# Altium schematic sheet Project_Kondrashova_motor_driver.SchDoc: =title_line_1 + title_line_2
size 594 x 420 mm; SheetNumber: n
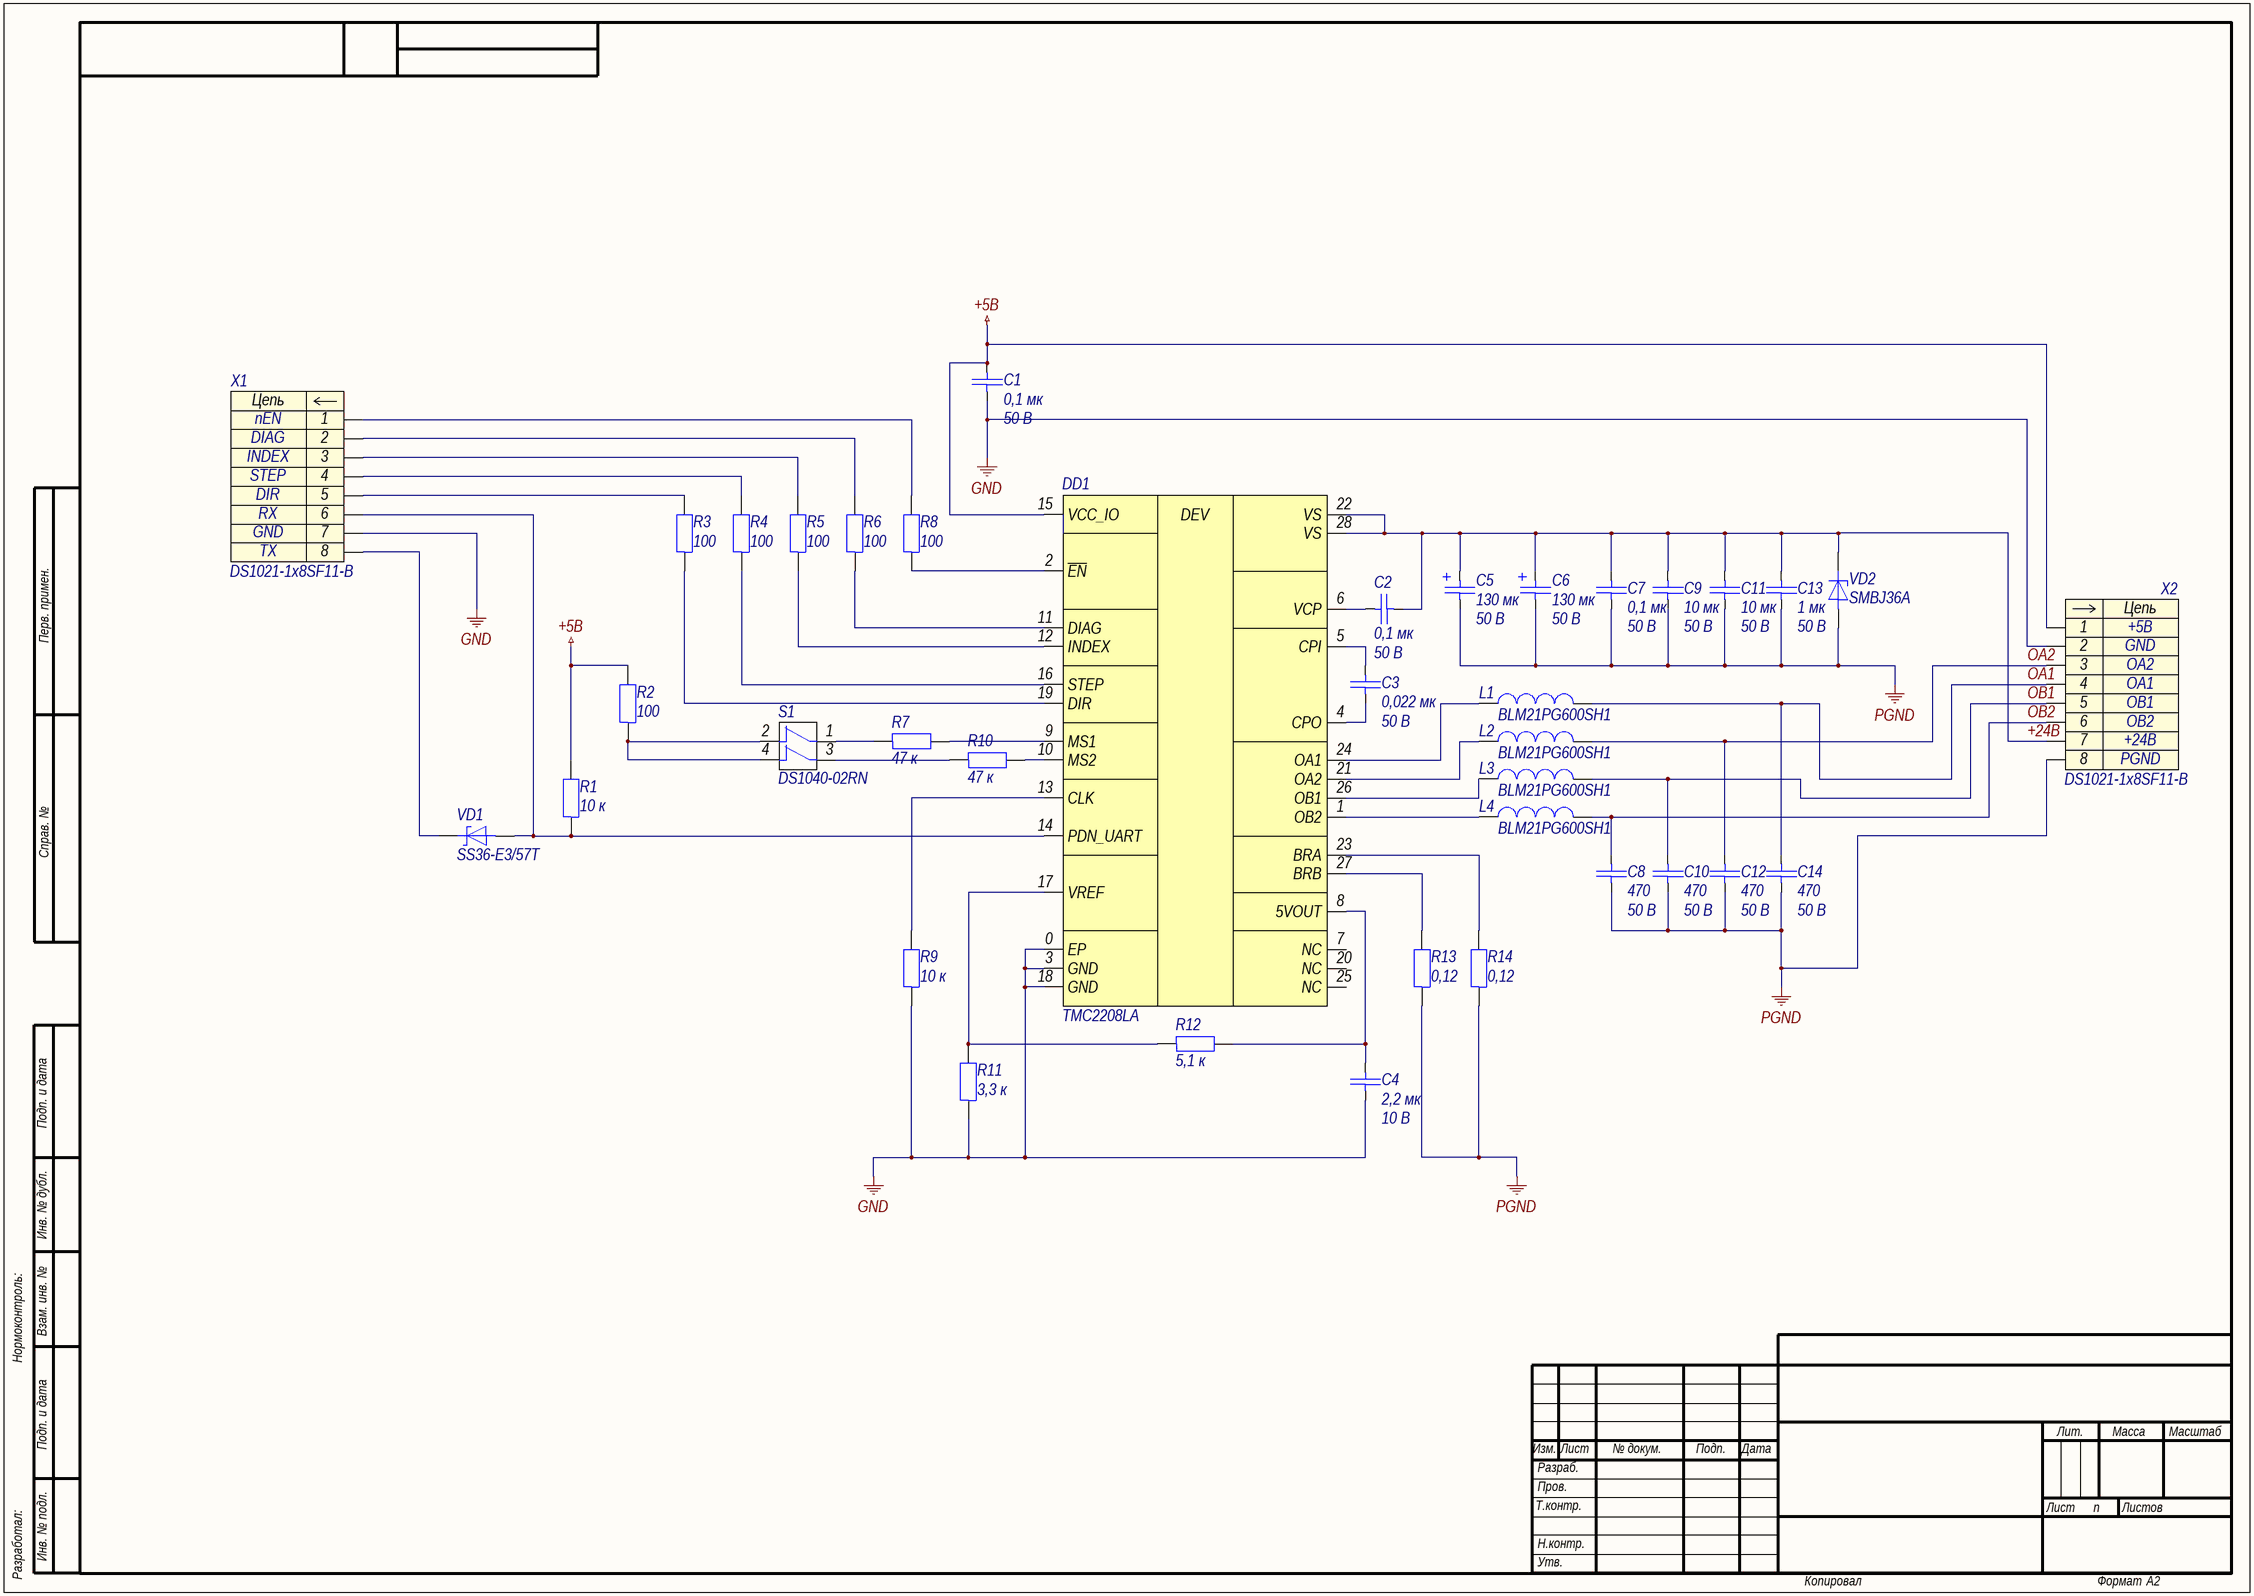
[diagram p0: Project_Kondrashova_motor_driver.SchDoc]

## Parts
C1  0,1 мк  Напряжение: 50 В  [C0603]
C2  0,1 мк  Напряжение: 50 В  [C0603]
C3  0,022 мк  Напряжение: 50 В  [C0603]
C4  2,2 мк  Напряжение: 10 В  [C0603]
C5  130 мк  Напряжение: 50 В  [C7343-43]
C6  130 мк  Напряжение: 50 В  [C7343-43]
C7  0,1 мк  Напряжение: 50 В  [C0603]
C8  470  Напряжение: 50 В  [C0603]
C9  10 мк  Напряжение: 50 В  [C2220]
C10  470  Напряжение: 50 В  [C0603]
C11  10 мк  Напряжение: 50 В  [C2220]
C12  470  Напряжение: 50 В  [C0603]
C13  1 мк  Напряжение: 50 В  [C1210]
C14  470  Напряжение: 50 В  [C0603]
DD1  TMC2208LA  [QFN-28-P50-500X500X90-L55X25-T310X310]
L1  BLM21PG600SH1  [MI-2-0805]
L2  BLM21PG600SH1  [MI-2-0805]
L3  BLM21PG600SH1  [MI-2-0805]
L4  BLM21PG600SH1  [MI-2-0805]
R1  10 к  [R0603]
R2  100  [R0603]
R3  100  [R0603]
R4  100  [R0603]
R5  100  [R0603]
R6  100  [R0603]
R7  47 к  [R0603]
R8  100  [R0603]
R9  10 к  [R0603]
R10  47 к  [R0603]
R11  3,3 к  [R0603]
R12  5,1 к  [R0603]
R13  0,12  [R0603]
R14  0,12  [R0603]
S1  DS1040-02RN  [DS1040-02RN]
VD1  SS36-E3/57T  [DO-214AB-790X590X262]
VD2  SMBJ36A  [SMBJ36A]
X1  DS1021-1x8SF11-B  [DS1021-1X8SF11-B]
X2  DS1021-1x8SF11-B  [DS1021-1X8SF11-B]

## Nets
+5В: C1.1 DD1.15(VCC_IO) R1.2 R2.2 X2.1
GND: C1.2 C4.2 DD1.0(EP) DD1.3(GND) DD1.18(GND) R9.1 R11.1 X1.7 X2.2
PGND: C5.2 C6.2 C7.2 C8.2 C9.2 C10.2 C11.2 C12.2 C13.2 C14.2 R13.1 R14.1 VD2.2 X2.8
+24В: C2.2 C5.1 C6.1 C7.1 C9.1 C11.1 C13.1 DD1.22(VS) DD1.28(VS) VD2.1 X2.7
OA1: C14.1 L1.2 X2.4
OA2: C12.1 L2.2 X2.3
OB1: C10.1 L3.2 X2.5
OB2: C8.1 L4.2 X2.6
NetC2_1: C2.1 DD1.6(VCP)
NetC3_1: C3.1 DD1.5(CPI)
NetC3_2: C3.2 DD1.4(CPO)
NetC4_1: C4.1 DD1.8(5VOUT) R12.2
NetDD1_1: DD1.1(OB2) L4.1
NetDD1_2: DD1.2(~{EN}) R8.1
NetDD1_9: DD1.9(MS1) R7.2
NetDD1_10: DD1.10(MS2) R10.2
NetDD1_11: DD1.11(DIAG) R6.1
NetDD1_12: DD1.12(INDEX) R5.1
NetDD1_13: DD1.13(CLK) R9.2
NetDD1_14: DD1.14(PDN_UART) R1.1 VD1.2 X1.6
NetDD1_16: DD1.16(STEP) R4.1
NetDD1_17: DD1.17(VREF) R11.2 R12.1
NetDD1_19: DD1.19(DIR) R3.1
NetDD1_21: DD1.21(OA2) L2.1
NetDD1_23: DD1.23(BRA) R14.2
NetDD1_24: DD1.24(OA1) L1.1
NetDD1_26: DD1.26(OB1) L3.1
NetDD1_27: DD1.27(BRB) R13.2
NetR2_1: R2.1 S1.2 S1.4
NetR3_2: R3.2 X1.5
NetR4_2: R4.2 X1.4
NetR5_2: R5.2 X1.3
NetR6_2: R6.2 X1.2
NetR7_1: R7.1 S1.1
NetR8_2: R8.2 X1.1
NetR10_1: R10.1 S1.3
NetVD1_1: VD1.1 X1.8

Not connected (* = marked no-connect by the designer): DD1 7(NC) 20(NC) 25(NC)

## Notes on the sheet
- Перв. примен.
- Справ. №
- Подп. и дата
- Инв. № дубл.
- Нормоконтроль:
- Взам. инв. №
- Изм.
- Лист
- № докум.
- Подп.
- Дата
- Лит.
- Масса
- Масштаб
- Т.контр.
- Пров.
- Разраб.
- Листов
- Разработал:
- Инв. № подл.
- Н.контр.
- Утв.
- Копировал
- Формат
- А2
- (in symbol dd0002) DEV
- (in symbol x0024) Цепь

## Library data of the parts
C1 C2 C7 = c0063: =Описание; ID: c0063; Фамилия: Ларионов; Описание: Конденсатор керамический чип 0603 100 нФ 50 В ±5 %; Наименование: CC0603JRX7R9BB104; Производитель: YAGEO Corp.; Отклонение: ±5 %; Рабочие температуры: от –55 °С до +125 °С; Температурный коэффициент емкости: X7R; Корпус: 0603; Номинал: 0,1 мк; Номинальное напряжение: 50 В; HelpURL: https://www.yageo.com/upload/media/product/productsearch/datasheet/mlcc/UPY-GPHC_X7R_6.3V-to-50V_20.pdf
C3 = c0047: =Описание; ID: c0047; Фамилия: Паньков; Описание: Конденсатор керамический чип 0603 22 нФ 50 В ±10 %; Наименование: CC0603KRX7R9BB223; Производитель: YAGEO Corp.; Отклонение: ±10 %; Рабочие температуры: от –55 °С до +125 °С; Температурный коэффициент емкости: X7R; Корпус: 0603; Номинал: 0,022 мк; Номинальное напряжение: 50 В; HelpURL: https://www.yageo.com/upload/media/product/productsearch/datasheet/mlcc/UPY-GPHC_X7R_6.3V-to-50V_20.pdf
C4 = c0099: =Описание; ID: c0099; Фамилия: Паньков; Описание: Конденсатор керамический чип 0603 2,2 мкФ 10 В ±10 %; Наименование: CC0603KRX5R6BB225; Производитель: YAGEO Corp.; Отклонение: ±10 %; Рабочие температуры: от –55 °С до +85 °С; Температурный коэффициент емкости: X5R; Корпус: 0603; Номинал: 2,2 мк; Номинальное напряжение: 10 В; HelpURL: https://www.yageo.com/upload/media/product/productsearch/datasheet/mlcc/UPY-GPHC_X5R_4V-to-50V_26.pdf
C5 C6 = c0150: =Описание; ID: c0150; Фамилия: Паньков; Описание: Конденсатор танталовый чип 7343-43 150 мкФ 16 В ±10 %; Наименование: 293D157X9016E2TE3; Производитель: Vishay Intertechnology, Inc.; Отклонение: ±10 %; Эквивалентное последовательное сопротивление: 0,5 Ом; Среднеквадратичный размах пульсации тока: 0,57 А; Рабочие температуры: от –55 °С до +125 °С; Корпус: 7343-43; Номинал: 130 мк; Номинальное напряжение: 50 В; HelpURL: https://www.vishay.com/capacitors/list/product-40002/
C8 C10 C12 C14 = c0154: =Описание; ID: c0154; Описание: Конденсатор керамический чип 0603 470мкФ 50 В ±5 %; Наименование: CC0603JPX7R9BB101; Производитель: YAGEO Corp.; Отклонение: ±5 %; Рабочие температуры: от –55 °С до +125 °С; Температурный коэффициент емкости: X7R; Корпус: 0603; Номинал: 470; Номинальное напряжение: 50 В; HelpURL: https://www.yageo.com/upload/media/product/productsearch/datasheet/mlcc/UPY-GPHC_X7R_6.3V-to-50V_20.pdf
C9 C11 = c0152: =Описание; ID: c0152; Описание: Конденсатор керамический чип 2220 10 мк 50 В ±2 %; Производитель: KEMET Corporation; Отклонение: ±2 %; Рабочие температуры: от –55 °С до +125 °С; Температурный коэффициент емкости: X7R; Корпус: 2220; Номинал: 10 мк; Номинальное напряжение: 50 В
C13 = c0153: =Описание; ID: c0153; Описание: Конденсатор керамический чип 1210 1 мк 50 В ±10 %; Производитель: YAGEO Corp.; Отклонение: ±5 %; Рабочие температуры: от –55 °С до +125 °С; Температурный коэффициент емкости: C0G; Корпус: 1210; Номинал: 1 мк; Номинальное напряжение: 50 В; HelpURL: https://www.yageo.com/upload/media/product/productsearch/datasheet/mlcc/UPY-NP0X7R_MV_100-to-630V_22.pdf
DD1 = dd0002: =Описание; ID: dd0002
L1-L4 = l0004: =Описание; ID: l0004; Фамилия: Самарин; Описание: Ферритовая бусина 60 Ом ±25 %; Производитель: Murata Manufacturing Co., Ltd.; Сопротивление, 100 МГц: 60 Ом; Отклонение, 100 МГц: ±25 %; Сопротивление при постоянном токе: 0,1 Ом; Рабочие температуры: от –55 °С до +125 °С; Корпус: 0805; Наименование: BLM21PG600SH1; HelpURL: https://www.laird.com/products/inductive-components-emc-components-and-ferrite-cores/ferrite-chip-beads/0805-series/mi0805k400r-10
R1 R9 = r0105: =Описание; ID: r0105; Фамилия: Самарин; Описание: Резистор чип 0603 10 кОм ±1 % 0,1 Вт; Наименование: RC0603FR-0710KL; Производитель: YAGEO Corp.; Отклонение: ±1 %; Номинальное напряжение: 75 В; Номинальный ток: 1 А; Рабочие температуры: от –55 °С до +155 °С; Корпус: 0603; Примечание: Ряд E24; Номинал: 10 к; HelpURL: https://www.yageo.com/upload/media/product/productsearch/datasheet/rchip/PYu-RC_Group_51_RoHS_L_11.pdf
R2-R6 R8 = r0052: =Описание; ID: r0052; Фамилия: Самарин; Описание: Резистор чип 0603 100 Ом ±1 % 0,1 Вт; Наименование: RC0603FR‍‐07100RL; Производитель: YAGEO Corp.; Отклонение: ±1 %; Номинальное напряжение: 75 В; Номинальный ток: 1 А; Рабочие температуры: от –55 °С до +155 °С; Корпус: 0603; Примечание: Ряд E24; Номинал: 100; HelpURL: https://www.yageo.com/upload/media/product/productsearch/datasheet/rchip/PYu-RC_Group_51_RoHS_L_11.pdf
R7 R10 = r0129: =Описание; ID: r0129; Фамилия: Паньков; Описание: Резистор чип 0603 47 кОм ±1 % 0,1 Вт; Наименование: RC0603FR-0747KL; Производитель: YAGEO Corp.; Отклонение: ±1 %; Номинальное напряжение: 75 В; Номинальный ток: 1 А; Рабочие температуры: от –55 °С до +155 °С; Корпус: 0603; Примечание: Ряд E24; Номинал: 47 к; HelpURL: https://www.yageo.com/upload/media/product/productsearch/datasheet/rchip/PYu-RC_Group_51_RoHS_L_11.pdf
R11 = r0089: =Описание; ID: r0089; Фамилия: Паньков; Описание: Резистор чип 0603 3,3 кОм ±1 % 0,1 Вт; Наименование: RC0603FR-073K3L; Производитель: YAGEO Corp.; Отклонение: ±1 %; Номинальное напряжение: 75 В; Номинальный ток: 1 А; Рабочие температуры: от –55 °С до +155 °С; Корпус: 0603; Примечание: Ряд E24; Номинал: 3,3 к; HelpURL: https://www.yageo.com/upload/media/product/productsearch/datasheet/rchip/PYu-RC_Group_51_RoHS_L_11.pdf
R12 = r0096: =Описание; ID: r0096; Фамилия: Жернаков; Описание: Резистор чип 0603 5,1 кОм ±1 % 0,1 Вт; Наименование: RC0603FR-075K1L; Производитель: YAGEO Corp.; Отклонение: ±1 %; Номинальное напряжение: 75 В; Номинальный ток: 1 А; Рабочие температуры: от –55 °С до +155 °С; Корпус: 0603; Примечание: Ряд E24; Номинал: 5,1 к; HelpURL: https://www.yageo.com/upload/media/product/productsearch/datasheet/rchip/PYu-RC_Group_51_RoHS_L_11.pdf
R13 R14 = r0183: =Описание; ID: r0183; Фамилия: Паньков; Описание: Резистор чип 0603 120 мОм ±1 % 0,2 Вт; Наименование: RCWE0603R120FKEA; Производитель: Vishay Intertechnology, Inc.; Отклонение: ±1 %; Номинальное напряжение: не указано; Рабочие температуры: от –55 °С до +155 °С; Корпус: 0603; Примечание: Ряд E24; Номинал: 0,12; Номинальный ток: не указано; HelpURL: https://www.vishay.com/resistors-fixed/list/product-20019/tab/documents/
S1 = s0009: =Описание; ID: s0009; Фамилия: Паньков; Описание: 2-х позиционный движковый переключатель; Производитель: Connfly Electronic Co., Ltd.; Ток нагрузки: 100 мА @ 24 В; Сопротивление контакта: 100 мОм; Количество контактов: 4; Рабочие температуры: от –40 °С до +105 °С; Промывка: Запрещена; Корпус: 6,54 x 9,90 x 5,50; Наименование: DS1040-02RN; HelpURL: http://en.connfly.group/product/xVkr=EusQssAN0gN=Aos=mU+UrVkR9kqEAN0gN0IWS+QNB+A
VD1 = vd0005: =Описание; ID: vd0005; Фамилия: Жернаков; Описание: Диод Шоттки 60 В 3 А; Производитель: Vishay Intertechnology, Inc.; Максимальное прямое напряжение: 0,75 В; Максимальное обратное напряжение: 60 В; Максимальный прямой ток: 3 А; Рабочие температуры: от –55 °С до +150 °С; Корпус: DO-214AB; Наименование: SS36-E3/57T; HelpURL: https://www.vishay.com/product?docid=88751
VD2 = vd0031: =Описание; ID: vd0031; Фамилия: Жернаков; Описание: Стабилитрон 36 В; Производитель: Vishay Intertechnology, Inc.; Номинальное напряжение стабилизации: 36 В; Разброс напряжения стабилизации: 40,0…44,2 В; Номинальный ток стабилизации: 1 мА; Рабочие температуры: от –55 °С до +150 °С; Корпус: SMBJ036A; Наименование: SMBJ36A
X1 = x0024: =Описание; Contact_1: nEN; Contact_2: DIAG; Contact_3: INDEX; Contact_4: STEP; Contact_5: DIR; Contact_6: RX; Contact_7: GND; Contact_8: TX; ID: x0024; Фамилия: Паньков; Описание: PLS 8 pin 2,54 мм вилка прямой; Производитель: Connfly Electronic Co., Ltd.; Наименование: DS1021-1x8SF11-B; HelpURL: http://en.connfly.group/product/xVkr=EusQssAN0gN=Aos=mU+UrVkR9kqEAN0gN9g+WqANB+A
X2 = x0024: =Описание; Contact_1: +5В; Contact_2: GND; Contact_3: OA2; Contact_4: OA1; Contact_5: OB1; Contact_6: OB2; Contact_7: +24В; Contact_8: PGND; ID: x0024; Фамилия: Паньков; Описание: PLS 8 pin 2,54 мм вилка прямой; Производитель: Connfly Electronic Co., Ltd.; Наименование: DS1021-1x8SF11-B; HelpURL: http://en.connfly.group/product/xVkr=EusQssAN0gN=Aos=mU+UrVkR9kqEAN0gN9g+WqANB+A